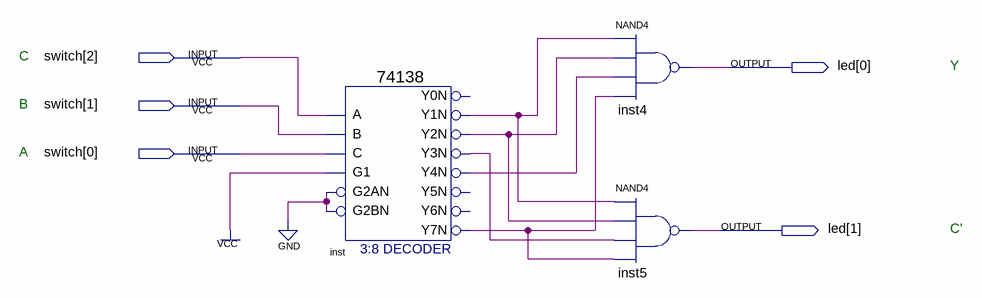
[diagram p0: schematic sheet]
// Quartus schematic pj404.bdf as structural Verilog: 3 symbols, 5 pins
module pj404 (
  input  [2:0] switch,
  output [1:0] led
);

  wire inst_y1n, inst_y2n, inst_y3n, inst_y4n, inst_y7n;

  \74138  inst (
    .A(switch[2]), .B(switch[1]), .G1(1'b1), .C(switch[0]), .G2AN(1'b0), .G2BN(1'b0), .Y1N(inst_y1n),
    .Y2N(inst_y2n), .Y3N(inst_y3n), .Y4N(inst_y4n), .Y7N(inst_y7n));  // open: Y0N, Y5N, Y6N
  nand inst4 (led[0], inst_y1n, inst_y2n, inst_y4n, inst_y7n);
  nand inst5 (led[1], inst_y1n, inst_y2n, inst_y3n, inst_y7n);

  // Notes on the sheet:
  //   C
  //   Y
  //   B
  //   A
  //   C'
endmodule
